# Altium schematic sheet ov_uv_dropout.SchDoc
size A4; Organization: Badgerloop; Address1: 133 Engineering Research; Address2: Building; Address3: Madison, WI 53715
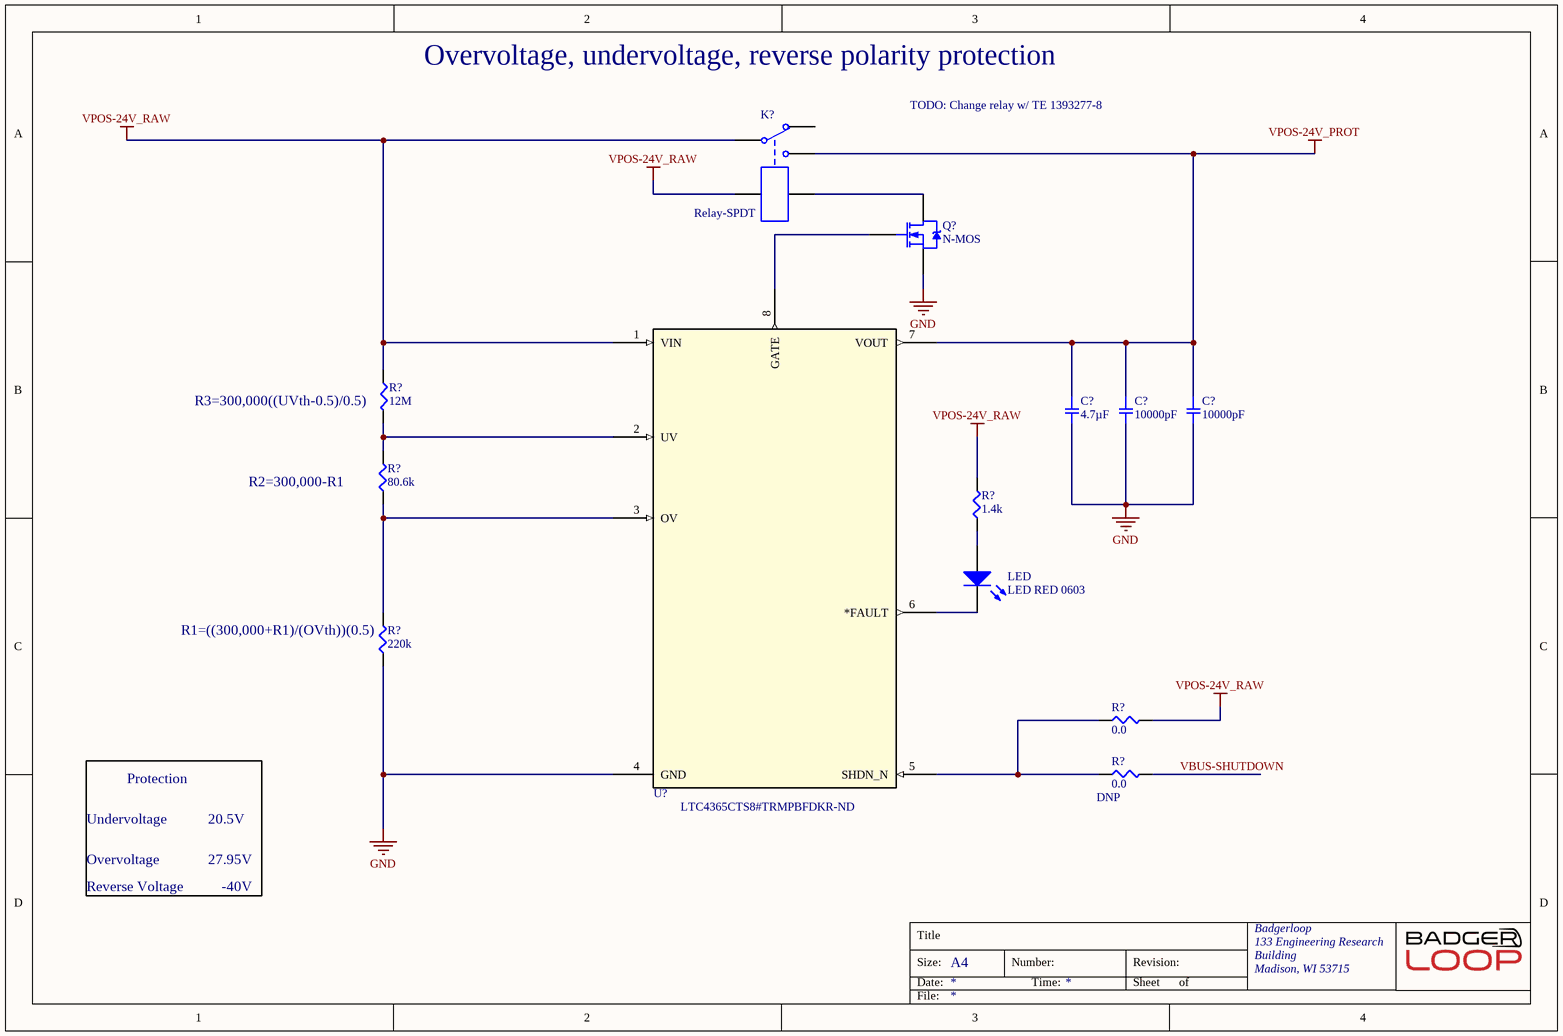
[diagram p0: ov_uv_dropout.SchDoc]

## Parts
(Parts that share a designator on the sheet are numbered #1, #2 ... from top to bottom, then left to right.)
C?#1  4.7µF  [SMD-0805C]
C?#2  10000pF  [SMD-0805C]
C?#3  10000pF  [SMD-0805C]
K?  Relay-SPDT  [MODULE5B]
LED  LED RED 0603  [LED 0603 RED]
Q?  N-MOS  [DPAK228P991X238-3N]
R?#1  12M  [SMD-1206-RES]
R?#2  80.6k  [SMD-0805-RES]
R?#3  1.4k  [SMD-0805-RES]
R?#4  220k  [SMD-0805-RES]
R?#5  0.0  [SMD-0805-RES]
R?#6  0.0  [SMD-0805-RES]
U?  Supplier Part Number 1: LTC4365CTS8#TRMPBFDKR-ND  [TSOT-23_TS8]  (hidden comment: LTC4365CTS8#TRMP)

## Nets
GND: C?#1.2 C?#2.2 C?#3.2 Q?.3(S) R?#4.1 U?.4(GND)
VPOS-24V_PROT: C?#1.1 C?#2.1 C?#3.1 K?.3 U?.7(VOUT)
VPOS-24V_RAW: K?.1 K?.4 R?#1.1 R?#3.2 R?#5.2 U?.1(VIN)
VBUS-SHUTDOWN: R?#6.2
NetK?_5: K?.5 Q?.4(D)
NetLED_1: LED.1(A) R?#3.1
NetLED_2: LED.2(K) U?.6(*FAULT)
NetQ?_1: Q?.1(G) U?.8(GATE)
NetR?#1_2: R?#1.2 R?#2.2 U?.2(UV)
NetR?#2_1: R?#2.1 R?#4.2 U?.3(OV)
NetR?#5_1: R?#5.1 R?#6.1 U?.5(SHDN_N)

Not connected (* = marked no-connect by the designer): K? 2

## Notes on the sheet
- Overvoltage, undervoltage, reverse polarity protection
- TODO: Change relay w/ TE 1393277-8
- (near R?#1) R3=300,000((UVth-0.5)/0.5)
- (near R?#2) R2=300,000-R1
- (near R?#4) R1=((300,000+R1)/(OVth))(0.5)
- Protection
- Undervoltage
- 20.5V
- Overvoltage
- Reverse Voltage
- 27.95V
- -40V
- Title
- Size:
- Date:
- A4
- Number:
- Time:
- Revision:
- Sheet
- of
- File:

## Library data of the parts
C?#1 = GRM21BR61H475KE51L: CAP CER 4.7UF 50V X5R 0805; Manufacturer: Murata Electronics North America; Factory Stock: 0; Unit Price (USD): 0.37; Minimum Quantity: 1; Tolerance: ±10%; Datasheets: http://www.murata.com/~/media/webrenewal/support/library/catalog/products/capacitor/mlcc/c02e.pdf; Image: //media.digikey.com/Renders/Murata%20Renders/0805%20(2012%20Metric)%20.85mm.jpg; Digi-Key Part Number: 490-10751-1-ND; Part Number: GRM21BR61H475KE51L; Quantity Available: 29522; @ qty: 0; Packaging: Cut Tape (CT); Series: GRM; Part Status: Active; Value: 4.7µF; Voltage: 50V; Temperature Coefficient: X5R; Operating Temperature: -55°C ~ 85°C; Features: -; Ratings: -; Applications: General Purpose; Mounting Type: Surface Mount, MLCC; Package / Case: 0805 (2012 Metric); Size / Dimension: 0.079" L x 0.049" W (2.00mm x 1.25mm); Height - Seated (Max): -; Thickness (Max): 0.055" (1.40mm); Lead Spacing: -; Lead Style: -
C?#2 C?#3 = GC321AD72E103KX01D: CAP CER 10000PF 250V X7T 0805; Manufacturer: Murata Electronics North America; Factory Stock: 0; Unit Price (USD): 0.3; Minimum Quantity: 1; Tolerance: ±10%; Datasheets: http://search.murata.co.jp/Ceramy/image/img/A01X/G101/ENG/GC321AD72E103KX01-01.pdf; Image: //media.digikey.com/Renders/Murata%20Renders/0805(GC3)200x125.jpg; Digi-Key Part Number: 490-13986-1-ND; Part Number: GC321AD72E103KX01D; Quantity Available: 4000; @ qty: 0; Packaging: Cut Tape (CT); Series: GC3; Part Status: Active; Value: 10000pF; Voltage: 250V; Temperature Coefficient: X7T; Operating Temperature: -55°C ~ 125°C; Features: -; Ratings: AEC-Q200; Applications: Automotive; Mounting Type: Surface Mount, MLCC; Package / Case: 0805 (2012 Metric); Size / Dimension: 0.079" L x 0.049" W (2.00mm x 1.25mm); Height - Seated (Max): -; Thickness (Max): 0.039" (1.00mm); Lead Spacing: -; Lead Style: -
K? = Relay-SPDT: Single-Pole Dual-Throw Relay; Published: 24-Mar-1999; LatestRevisionDate: 17-Jul-2002; LatestRevisionNote: Re-released for DXP Platform.; PackageReference: MODULE5B; Publisher: Altium Limited
LED = LED RED 0603: Red 631nm LED Indication - Discrete 2V 0603 (1608 Metric); Manufacturer: Lite-On Inc.; Manufacturer P/N: LTST-C190KRKT; Digikey P/N: 160-1436-1-ND; Package / Case: 0603; Color: RED
Q? = N-MOS: N-Channel Power MOSFET, 12 A, 60 V; Manufacturer: ON SEMI; Manufacturer P/N: NTD3055L104T4G; Digikey Link: https://www.digikey.com/product-detail/en/on-semiconductor/NTD3055L104T4G/NTD3055L104T4GOSDKR-ND/1749196; Digikey P/N: NTD3055L104T4GOSDKR-ND
R?#1 = ERJ-8GEYK126V: RES SMD 12M OHM 10% 1/4W 1206; Manufacturer: Panasonic Electronic Components; Factory Stock: 0; Unit Price (USD): 0.00670; @ qty: 1500; Minimum Quantity: 1; Power (Watts): 0.25W, 1/4W; Temperature Coefficient: -400/ +150ppm/°C; Part Number: ERJ-8GEYK126V; Datasheets: http://industrial.panasonic.com/cdbs/www-data/pdf/RDA0000/AOA0000CE1.pdf; Image: //media.digikey.com/Renders/Panasonic%20Renders/ERJ-1206%20Pkg.jpg; Digi-Key Part Number: P12MECT-ND; Quantity Available: 31043; Packaging: Cut Tape (CT); Series: ERJ; Part Status: Active; Value: 12M; Tolerance: ±10%; Composition: Thick Film; Features: Automotive AEC-Q200; Operating Temperature: -55°C ~ 155°C; Package / Case: 1206 (3216 Metric); Supplier Device Package: 1206; Size / Dimension: 0.126" L x 0.063" W (3.20mm x 1.60mm); Height - Seated (Max): 0.028" (0.70mm); Number of Terminations: 2; Failure Rate: -
R?#2 = ERJ-6ENF8062V: RES SMD 80.6K OHM 1% 1/8W 0805; Manufacturer: Panasonic Electronic Components; Factory Stock: 0; Unit Price (USD): 0.00729; @ qty: 1500; Minimum Quantity: 1; Power (Watts): 0.125W, 1/8W; Temperature Coefficient: ±100ppm/°C; Part Number: ERJ-6ENF8062V; Datasheets: http://industrial.panasonic.com/www-cgi/jvcr13pz.cgi?E+PZ+3+AOA0002+ERJ6ENF8062V+7+WW; Image: //media.digikey.com/Renders/Panasonic%20Renders/ERJ-0805%20Pkg.jpg; Digi-Key Part Number: P80.6KCCT-ND; Quantity Available: 48051; Packaging: Cut Tape (CT); Series: ERJ; Part Status: Active; Value: 80.6k; Tolerance: ±1%; Composition: Thick Film; Features: Automotive AEC-Q200; Operating Temperature: -55°C ~ 155°C; Package / Case: 0805 (2012 Metric); Supplier Device Package: 0805; Size / Dimension: 0.079" L x 0.049" W (2.00mm x 1.25mm); Height - Seated (Max): 0.028" (0.70mm); Number of Terminations: 2; Failure Rate: -
R?#3 = ERJ-6ENF1401V: RES SMD 1.4K OHM 1% 1/8W 0805; Manufacturer: Panasonic Electronic Components; Factory Stock: 0; Unit Price (USD): 0.00729; @ qty: 1500; Minimum Quantity: 1; Power (Watts): 0.125W, 1/8W; Temperature Coefficient: ±100ppm/°C; Part Number: ERJ-6ENF1401V; Datasheets: http://industrial.panasonic.com/www-cgi/jvcr13pz.cgi?E+PZ+3+AOA0002+ERJ6ENF1401V+7+WW; Image: //media.digikey.com/Renders/Panasonic%20Renders/ERJ-0805%20Pkg.jpg; Digi-Key Part Number: P1.40KCCT-ND; Quantity Available: 52856; Packaging: Cut Tape (CT); Series: ERJ; Part Status: Active; Value: 1.4k; Tolerance: ±1%; Composition: Thick Film; Features: Automotive AEC-Q200; Operating Temperature: -55°C ~ 155°C; Package / Case: 0805 (2012 Metric); Supplier Device Package: 0805; Size / Dimension: 0.079" L x 0.049" W (2.00mm x 1.25mm); Height - Seated (Max): 0.028" (0.70mm); Number of Terminations: 2; Failure Rate: -
R?#4 = ERJ-P06J224V: RES SMD 220K OHM 5% 1/2W 0805; Manufacturer: Panasonic Electronic Components; Factory Stock: 0; Unit Price (USD): 0.01839; @ qty: 1500; Minimum Quantity: 1; Power (Watts): 0.5W, 1/2W; Temperature Coefficient: ±200ppm/°C; Part Number: ERJ-P06J224V; Datasheets: https://industrial.panasonic.com/cdbs/www-data/pdf/RDA0000/AOA0000C243.pdf; Image: //media.digikey.com/Renders/Panasonic%20Renders/ERJ-0805%20Pkg.jpg; Digi-Key Part Number: P220KADCT-ND; Quantity Available: 20074; Packaging: Cut Tape (CT); Series: ERJ; Part Status: Active; Value: 220k; Tolerance: ±5%; Composition: Thick Film; Features: Automotive AEC-Q200, Pulse Withstanding; Operating Temperature: -55°C ~ 155°C; Package / Case: 0805 (2012 Metric); Supplier Device Package: 0805; Size / Dimension: 0.079" L x 0.049" W (2.00mm x 1.25mm); Height - Seated (Max): 0.028" (0.70mm); Number of Terminations: 2; Failure Rate: -
R?#5 R?#6 = ERJ-6GEY0R00V: RES SMD 0.0 OHM JUMPER 1/8W 0805; Manufacturer: Panasonic Electronic Components; Factory Stock: 0; Unit Price (USD): 0.00544; @ qty: 1500; Minimum Quantity: 1; Power (Watts): 0.125W, 1/8W; Part Number: ERJ-6GEY0R00V; Datasheets: http://industrial.panasonic.com/www-cgi/jvcr13pz.cgi?E+PZ+3+AOA0001+ERJ6GEY0R00V+7+WW; Image: //media.digikey.com/Renders/Panasonic%20Renders/ERJ-0805%20Pkg.jpg; Digi-Key Part Number: P0.0ACT-ND; Quantity Available: 1597627; Packaging: Cut Tape (CT); Series: ERJ; Part Status: Active; Value: 0.0; Tolerance: Jumper; Composition: Thick Film; Features: Automotive AEC-Q200; Temperature Coefficient: -; Operating Temperature: -55°C ~ 155°C; Package / Case: 0805 (2012 Metric); Supplier Device Package: 0805; Size / Dimension: 0.079" L x 0.049" W (2.00mm x 1.25mm); Height - Seated (Max): 0.028" (0.70mm); Number of Terminations: 2; Failure Rate: -
  R?#6: DNP: DNP
U? = LTC4365CTS8#TRMP: Overvoltage, / Undervoltage and Reverse / Supply Protection Controller; Manufacturer_Part_Number: LTC4365CTS8#TRMPBF; Vendor: Linear Technology; RefDes: RefDes; Type: DEV; Value: Value; Supplier 1: Digi-Key